# Altium schematic sheet [03] - WiFi.SchDoc
size A4
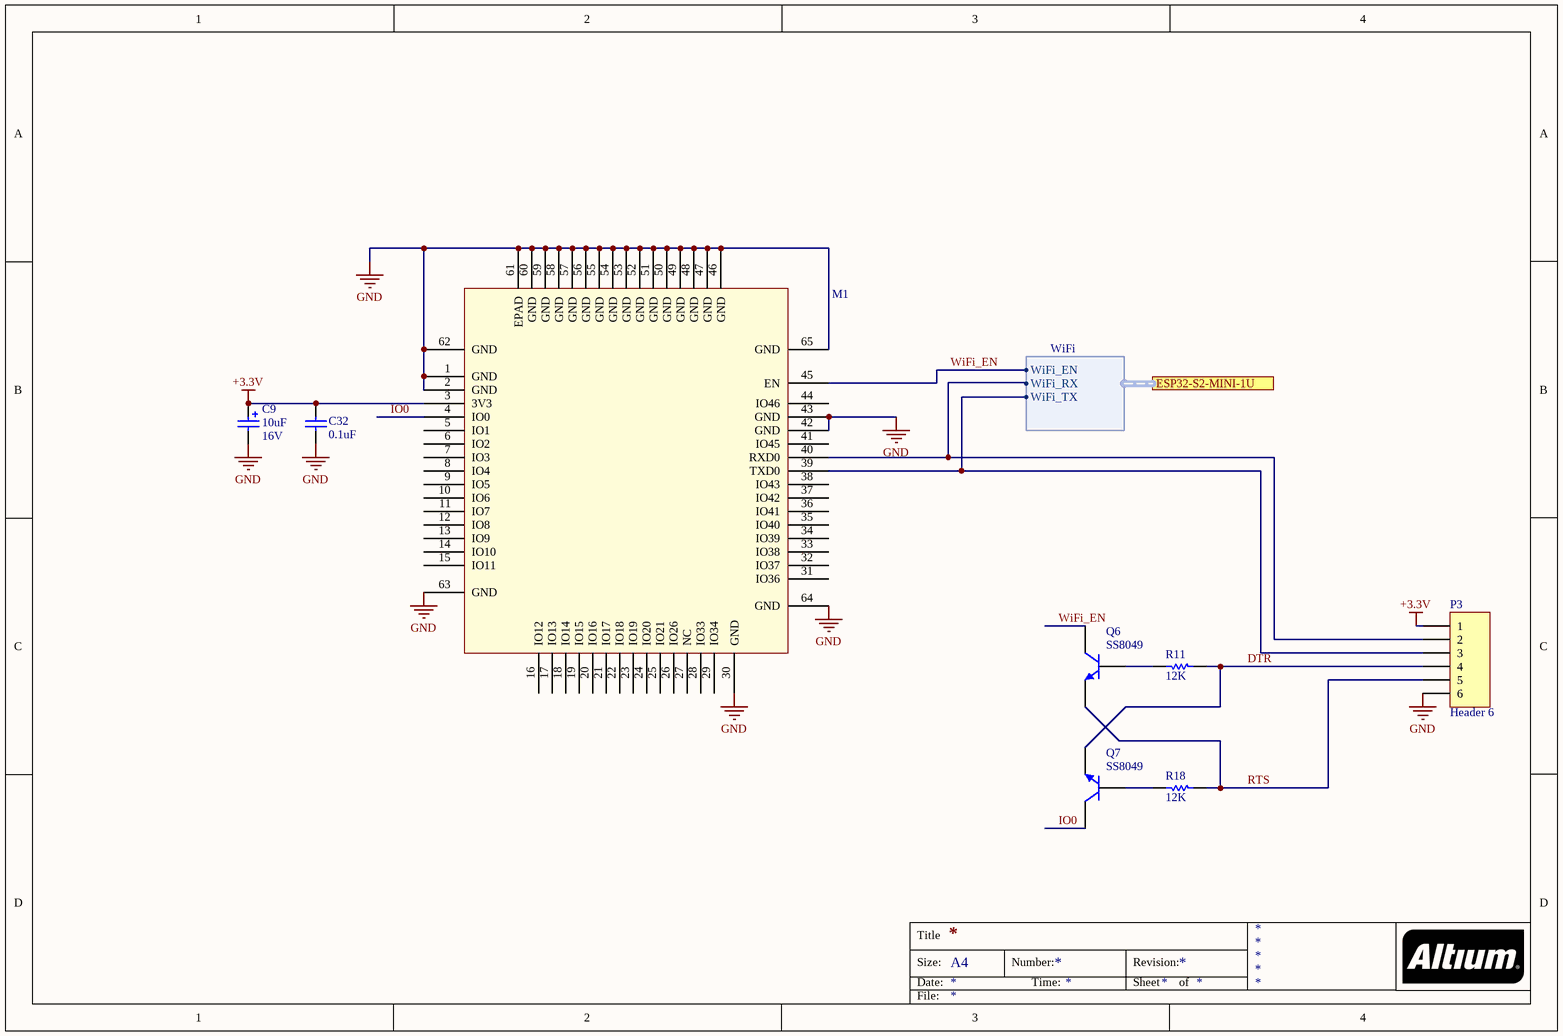
[diagram p0: [03] - WiFi.SchDoc]

## Parts
C9  Capacitance: 10uF  Voltage Rating: 16V  [Tantalum 3216 A]  (hidden comment: Capacitor Polarized)
C32  value 0.1uF  [0603_C]  (hidden comment: Cap)
M1  ESP32-S2-MINI-1U _Module  [ESP32-S2-MINI-1U]  (value not drawn)
P3  Header 6  [HDR1X6]
Q6  SS8049  [SOT23-3]
Q7  SS8049  [SOT23-3]
R11  Resistance: 12K  [Res-0603]  (hidden comment: Res1)
R18  Resistance: 12K  [Res-0603]  (hidden comment: Res1)

## Ports
ESP32-S2-MINI-1U (harness WiFi)

## Harnesses
WiFi: WiFi_EN, WiFi_RX, WiFi_TX

## Nets
+3.3V: C9.1 C32.2 M1.3(3V3) P3.1
GND: C9.2 C32.1 M1.1(GND) M1.2(GND) M1.30(GND) M1.42(GND) M1.43(GND) M1.46(GND) M1.47(GND) M1.48(GND) M1.49(GND) M1.50(GND) M1.51(GND) M1.52(GND) M1.53(GND) M1.54(GND) M1.55(GND) M1.56(GND) M1.57(GND) M1.58(GND) M1.59(GND) M1.60(GND) M1.61(EPAD) M1.62(GND) M1.63(GND) M1.64(GND) M1.65(GND) P3.6
DTR: P3.4 Q7.2(E) R11.2
IO0: M1.4(IO0) Q7.3(C)
RTS: P3.5 Q6.2(E) R18.2
WiFi_EN: M1.45(EN) Q6.3(C) ; port ESP32-S2-MINI-1U.WiFi_EN
NetM1_39: M1.39(TXD0) P3.3 ; port ESP32-S2-MINI-1U.WiFi_TX
NetM1_40: M1.40(RXD0) P3.2 ; port ESP32-S2-MINI-1U.WiFi_RX
NetQ6_1: Q6.1(B) R11.1
NetQ7_1: Q7.1(B) R18.1

Not connected (* = marked no-connect by the designer): M1 5(IO1) 6(IO2) 7(IO3) 8(IO4) 9(IO5) 10(IO6) 11(IO7) 12(IO8) 13(IO9) 14(IO10) 15(IO11) 16(IO12) 17(IO13) 18(IO14) 19(IO15) 20(IO16) 21(IO17) 22(IO18) 23(IO19) 24(IO20) 25(IO21) 26(IO26) 27(NC) 28(IO33) 29(IO34) 31(IO36) 32(IO37) 33(IO38) 34(IO39) 35(IO40) 36(IO41) 37(IO42) 38(IO43) 41(IO45) 44(IO46)

## Notes on the sheet
- Title
- Size:
- Date:
- A4
- Number:
- Time:
- Revision:
- Sheet
- of
- File:

## Library data of the parts
C9 = 2: CAP TANT 10UF 10% 16V 1206; Manufacturer: Vishay Sprague; Manufacturer Part Number: 293D106X9016A2TE3; Dielectric Material: Tantalum; ESR (Equivalent Series Resistance): 3R; Ripple Current: 160mA; Leakage Current: 1.6uA; Polarity: Polar; Dissipation Factor: 6%; Q Factor: 6; Supplier 1: Digi-Key; Supplier Part Number 1: 718-1123-1-ND; RoHS: Yes; Category: Tantalum Capacitors; Stock 1: 76138; Pricing 1: 1=0,54000, 10=0,38000, 50=0,28720, 100=0,25010, 500=0,18524, 1000=0,15745 (USD); Mount: Surface Mount,PCB; Case/Package: 1206; Case Code (Imperial): 1206; Case Code (Metric): 3216; Min Operating Temperature: -55°C; Max Operating Temperature: 125°C; Tolerance: 10%; Packaging: Tape and Reel; Package Quantity: 1; Voltage Rating (DC): 16V; Termination: SMD/SMT; Voltage: 16V; Features: General Purpose; Series: TANTAMOUNT® 293D; Length: 3.2mm; Width: 1.6mm; Height: 1.6mm; Height - Seated (Max): 0.071inch; Depth: 1.6mm; Radiation Hardening: No; REACH SVHC: Unknown; Lead Free: Lead Free; RoHS Compliant: Yes; ComponentLink1URL: https://datasheet.ciiva.com/11793/0900766b80d97b37-11793412.pdf?src-supplier=RSComponents; ComponentLink1Description: https://datasheet.ciiva.com/11793/0900766b80d97b37-11793412.pdf?src-supplier=RSComponents; ComponentLink2URL: https://datasheet.ciiva.com/257/293d-257982.pdf?src-supplier=Digi-Key; ComponentLink2Description: https://datasheet.ciiva.com/257/293d-257982.pdf?src-supplier=Digi-Key; ComponentLink3URL: https://datasheet.ciiva.com/257/293d-257983.pdf?src-supplier=Digi-Key; ComponentLink3Description: https://datasheet.ciiva.com/257/293d-257983.pdf?src-supplier=Digi-Key; ComponentLink4URL: https://datasheet.ciiva.com/1463/293d-1463155.pdf?src-supplier=Element14; ComponentLink4Description: https://datasheet.ciiva.com/1463/293d-1463155.pdf?src-supplier=Element14; ComponentLink5URL: https://datasheet.ciiva.com/3003/293d-3003829.pdf?src-supplier=Avnet; ComponentLink5Description: https://datasheet.ciiva.com/3003/293d-3003829.pdf?src-supplier=Avnet; ComponentLink6URL: https://datasheet.ciiva.com/16308/293d-16308277.pdf?src-supplier=Future+Electronics; ComponentLink6Description: https://datasheet.ciiva.com/16308/293d-16308277.pdf?src-supplier=Future+Electronics; ComponentLink7URL: https://datasheet.ciiva.com/22695/1910915-22695111.pdf?src-supplier=Element14; ComponentLink7Description: https://datasheet.ciiva.com/22695/1910915-22695111.pdf?src-supplier=Element14; ComponentLink8URL: https://datasheet.ciiva.com/257/293d-257981.pdf?src-supplier=Digi-Key; ComponentLink8Description: https://datasheet.ciiva.com/257/293d-257981.pdf?src-supplier=Digi-Key
C32 = Cap: Capacitor
M1 = ESP32-S2-MINI-1U _Module: Wi-Fi module; Datasheet: https://www.espressif.com/en/support/download/documents
P3 = Header 6: Header, 6-Pin; LatestRevisionDate: 17-Jul-2002; LatestRevisionNote: Re-released for DXP Platform.; Publisher: Altium Limited
Q6 Q7 = NPN: NPN Bipolar Transistor; Published: 8-Jun-2000; LatestRevisionDate: 17-Jul-2002; LatestRevisionNote: Re-released for DXP Platform.; PackageReference: TO-226-AA; Publisher: Altium Limited; PackageDescription: TO, Flat Index; 3 In-Line, Axial Leads; Body Dia. 4.8mm; Leads 0.55 x 0.51 mm (max); Code_JEDEC: TO-226-AA
R11 R18 = 1: Res Thkflm Anti-sulfurated 0603 100K Ohm 5% SMD; Manufacturer: Panasonic; Manufacturer Part Number: ERJ-U03J104V; Current Rating: 1A; Voltage Rating (DC): 75V; Power Rating: 100mW; Supplier 1: Digi-Key; Supplier Part Number 1: 10-ERJ-U03J104VCT-ND; Category: Chip SMD Resistors; Stock 1: 1856; Pricing 1: 1=0,10000, 10=0,07700, 100=0,02950, 1000=0,01298, 2500=0,01121 (USD); Case/Package: 0603; Weight: 7.1E-05oz; Case Code (Imperial): 0603; Case Code (Metric): 1608; Min Operating Temperature: -55°C; Max Operating Temperature: 155°C; Tolerance: 5%; Voltage Rating: 75V; Packaging: Tape and Reel; Package Quantity: 5000; Resistor Type: Thick Film; Termination: SMD/SMT; Length: 1.6mm; Width: 0.8mm; Height: 0.45mm; ComponentLink1URL: http://industrial.panasonic.com/www-cgi/jvcr13pz.cgi?E+PZ+3+AOA0005+ERJS06J821V+7+WW?src-supplier=Mouser; ComponentLink1Description: http://industrial.panasonic.com/www-cgi/jvcr13pz.cgi?E+PZ+3+AOA0005+ERJS06J821V+7+WW?src-supplier=Mouser; ComponentLink2URL: http://datasheet.octopart.com/ERJ-U03J104V-Panasonic-datasheet-61627662.pdf?src-supplier=Newark; ComponentLink2Description: http://datasheet.octopart.com/ERJ-U03J104V-Panasonic-datasheet-61627662.pdf?src-supplier=Newark; ComponentLink3URL: http://datasheet.octopart.com/ERJ-U03J104V-Panasonic-datasheet-33006993.pdf?src-supplier=Newark; ComponentLink3Description: http://datasheet.octopart.com/ERJ-U03J104V-Panasonic-datasheet-33006993.pdf?src-supplier=Newark; ComponentLink4URL: http://datasheet.octopart.com/ERJ-U03J104V-Panasonic-datasheet-78375410.pdf; ComponentLink4Description: http://datasheet.octopart.com/ERJ-U03J104V-Panasonic-datasheet-78375410.pdf